# Altium schematic sheet IrDA_TFDU6102.SchDoc: IrDA (Infra-red) LED
size A4; SheetNumber: 1; SheetTotal: 100; Organization: Altium Limited.; Address1: Level 3, 12a Rodborough Rd; Address2: Frenchs Forest 2086; Address3: NSW; Address4: AUSTRALIA
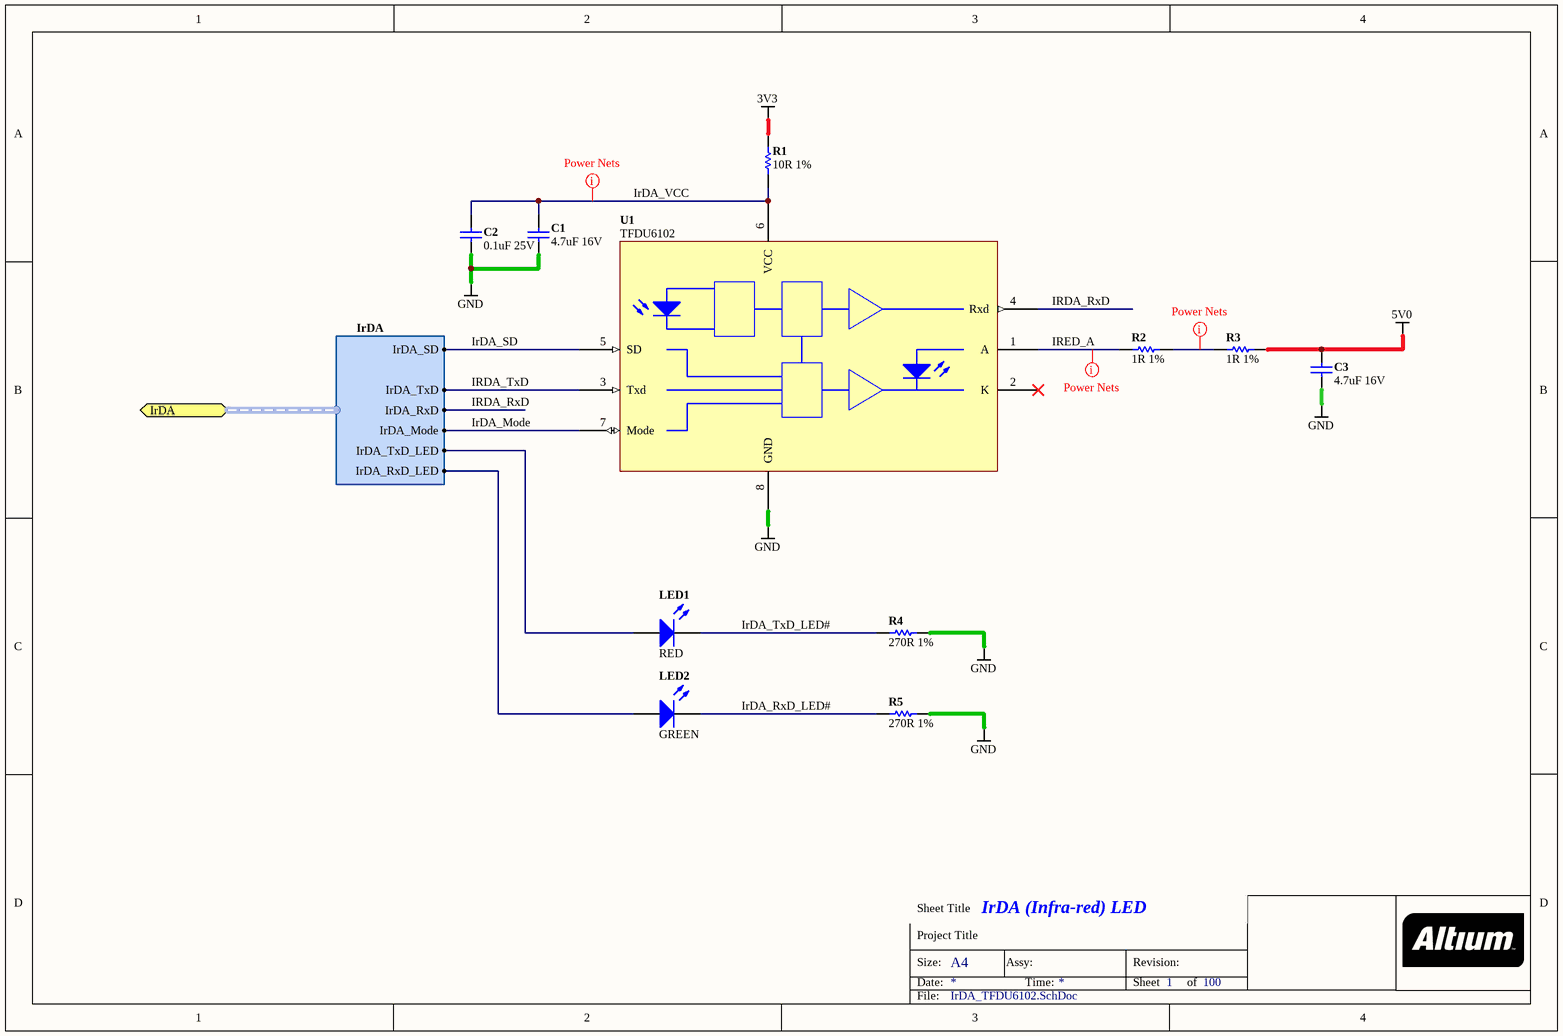
[diagram p0: IrDA_TFDU6102.SchDoc]

## Parts
C1  4.7uF 16V  [CAPC2012-STAR]
C2  0.1uF 25V  [CAPC1005-STAR]
C3  4.7uF 16V  [CAPC2012-STAR]
LED1  RED  [LED2012-STAR]
LED2  GREEN  [LED2012-STAR]
R1  10R 1%  [RESC2012-STAR]
R2  1R 1%  [RESC2012-STAR]
R3  1R 1%  [RESC2012-STAR]
R4  270R 1%  [RESC1005-STAR]
R5  270R 1%  [RESC1005-STAR]
U1  TFDU6102  [TFDU6102]

## Ports
IrDA (harness IrDA)

## Harnesses
IrDA: IrDA_SD, IrDA_TxD, IrDA_RxD, IrDA_TxD_LED, IrDA_Mode, IrDA_RxD_LED

## Nets
3V3: R1.2
5V0: C3.1 R3.2
GND: C1.2 C2.2 C3.2 R4.1 R5.1 U1.8(GND)
IrDA_Mode: U1.7(Mode) ; port IrDA.IrDA_Mode
IRDA_RxD: U1.4(Rxd) ; port IrDA.IrDA_RxD
IrDA_RxD_LED#: LED2.2(K) R5.2
IrDA_SD: U1.5(SD) ; port IrDA.IrDA_SD
IRDA_TxD: U1.3(Txd) ; port IrDA.IrDA_TxD
IrDA_TxD_LED#: LED1.2(K) R4.2
IrDA_VCC: C1.1 C2.1 R1.1 U1.6(VCC)
IRED_A: R2.1 U1.1(A)
NetLED1_1: LED1.1(A) ; port IrDA.IrDA_TxD_LED
NetLED2_1: LED2.1(A) ; port IrDA.IrDA_RxD_LED
NetR2_2: R2.2 R3.1

Not connected (* = marked no-connect by the designer): U1 2(K)*

## Layout directives
net class Power: IrDA_VCC, IRED_A, NetR2_2

## Notes on the sheet
- Sheet Title
- Project Title
- Size:
- Date:
- A4
- Assy:
- Time:
- Revision:
- Sheet
- of
- File:

## Library data of the parts
C1 C3 = D-101-0085: Capacitor, Ceramic, 4.7uF 10% 16V 0805 (2012) X7R; Polarity: Non-Polarized; Capacitance: 4.7 uF; Category: Capacitor; Dielectric: X7R; Mounting Technology: Surface Mount; Rated Voltage: 16 V; Status: Unreleased; Technology: None; Tolerance: 10 %
C2 = D-101-0045: Capacitor, Ceramic, 0.1uF 25V 0402 (1005); Dielectric: X7R; Polarity: Non-Polarized; Tolerance: 10 %; Capacitance: 0.1 uF; Category: Capacitor; Mounting Technology: Surface Mount; Rated Voltage: 25 V; Status: Deprecated; Technology: Ceramic
LED1 = D-153-0003: LED, Red 0805 (2013) HSMH-C170; Brightness: 17.0 mcd; Peak Wave Length: 639 nm; Category: LED; Color: N/A; Mounting Technology: Surface Mount; Status: Production
LED2 = D-153-0004: LED, Green 0805 (2012) KP-2012SGD; Brightness: 12.5 mcd; Peak Wave Length: 565 nm; Category: LED; Color: N/A; Mounting Technology: Surface Mount; Status: Production
R1 = D-100-0058: Resistor, 10R 1% 0805 (2012); Power Rating: mW; Category: Resistor; Mounting Technology: Surface Mount; Resistance: 10 R; Status: Production; Tolerance: 1 %
R2 R3 = D-100-0048: Resistor, 1R 1% 0805 (2012); Power Rating: 125 mW; Category: Resistor; Mounting Technology: Surface Mount; Resistance: 1 R; Status: Production; Tolerance: 1 %
R4 R5 = D-100-0111: Resistor, 270R 1% 0402 (1005); Power Rating: 63 mW; Category: Resistor; Mounting Technology: Surface Mount; Resistance: 270 R; Status: Production; Tolerance: 1 %
U1 = D-153-0000: LED, TFDU6102 Infrared Transceiver up to 4Mbits/s; Brightness: mcd; Peak Wave Length: nm; Category: LED; Color: N/A; Mounting Technology: Surface Mount; Status: Production